# Altium schematic sheet CONTROL_UNIT.SchDoc
size A; SheetNumber: 1; SheetTotal: 1
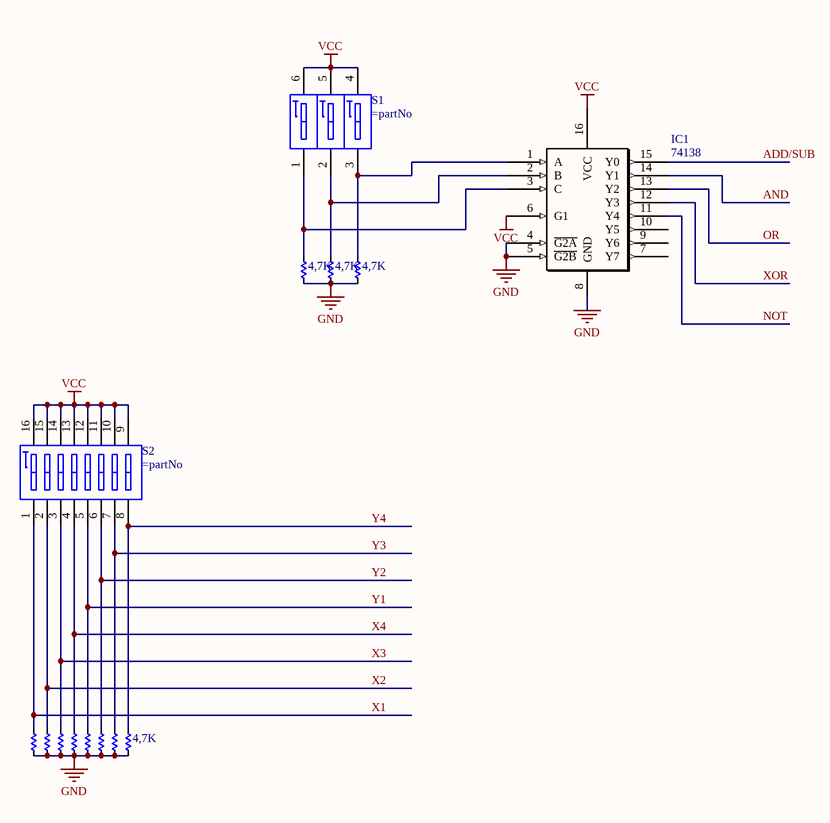
[diagram p0: CONTROL_UNIT.SchDoc]

## Parts
(Parts that share a designator on the sheet are numbered #1, #2 ... from top to bottom, then left to right.)
4,7K#1  (no value)  [RES-1/2W]
4,7K#2  (no value)  [RES-1/2W]
4,7K#3  (no value)  [RES-1/2W]
4,7K#4  (no value)  [RES-1/2W]
?#1  (no value)  [RES-1/2W]
?#2  (no value)  [RES-1/2W]
?#3  (no value)  [RES-1/2W]
?#4  (no value)  [RES-1/2W]
?#5  (no value)  [RES-1/2W]
?#6  (no value)  [RES-1/2W]
?#7  (no value)  [RES-1/2W]
IC1  74138  [DIP16]
S1  (no value)  [SW-DIP3]
S2  (no value)  [SW-DIP8]

## Nets
GND: 4,7K#1.2 4,7K#2.2 4,7K#3.2 4,7K#4.2 ?#1.2 ?#2.2 ?#3.2 ?#4.2 ?#5.2 ?#6.2 ?#7.2 IC1.4(~{G2A}) IC1.5(~{G2B}) IC1.8(GND)
VCC: IC1.6(G1) IC1.16(VCC) S1.4 S1.5 S1.6 S2.9 S2.10 S2.11 S2.12 S2.13 S2.14 S2.15 S2.16
ADD/SUB: IC1.15(Y0)
AND: IC1.14(Y1)
NOT: IC1.11(Y4)
OR: IC1.13(Y2)
X1: ?#1.1 S2.1
X2: ?#2.1 S2.2
X3: ?#3.1 S2.3
X4: ?#4.1 S2.4
XOR: IC1.12(Y3)
Y1: ?#5.1 S2.5
Y2: ?#6.1 S2.6
Y3: ?#7.1 S2.7
Y4: 4,7K#4.1 S2.8
Net4,7K#1_1: 4,7K#1.1 IC1.3(C) S1.1
Net4,7K#2_1: 4,7K#2.1 IC1.2(B) S1.2
Net4,7K#3_1: 4,7K#3.1 IC1.1(A) S1.3

Not connected (* = marked no-connect by the designer): IC1 7(Y7) 9(Y6) 10(Y5)

## Library data of the parts
4,7K#1-4,7K#4 ?#1-?#7 = Res: Manufacturer: Generic Components; Class: Passive; SubClass: R; Published: 08/06/2000; Publisher: Altium Hobart Technology Centre
IC1 = 74138: 3 -to- 8 Decoder - Out Low; Value: 74138; Copyright by: VanDungEvn@Gmail.com
S1 = SWDIP3: WS-DITV 2.54 mm small compact THT flat actuator with top tape; Manufacturer: Wurth Elektronik; Part No.: 418127160901; ComponentLink1 Description: Manufacturer; ComponentLink2 Description: Datasheet; Pole: 01; Created Date: Dec.2015; ComponentLink1URL: http://www.we-online.com; ComponentLink2URL: http://katalog.we-online.de/em/datasheet/4181271609xx.pdf; Created by: Baojun Chen
S2 = SWDIP8: WS-DITV 2.54 mm small compact THT flat actuator with top tape; Manufacturer: Wurth Elektronik; Part No.: 418127160908; ComponentLink1 Description: Manufacturer; ComponentLink2 Description: Datasheet; Pole: 08; Created Date: Dec.2015; ComponentLink1URL: http://www.we-online.com; ComponentLink2URL: http://katalog.we-online.de/em/datasheet/4181271609xx.pdf; Created by: Baojun Chen